# Altium schematic sheet STM32F1_microcontroller.SchDoc
size 420 x 297 mm; SheetNumber: 9; SheetTotal: 9
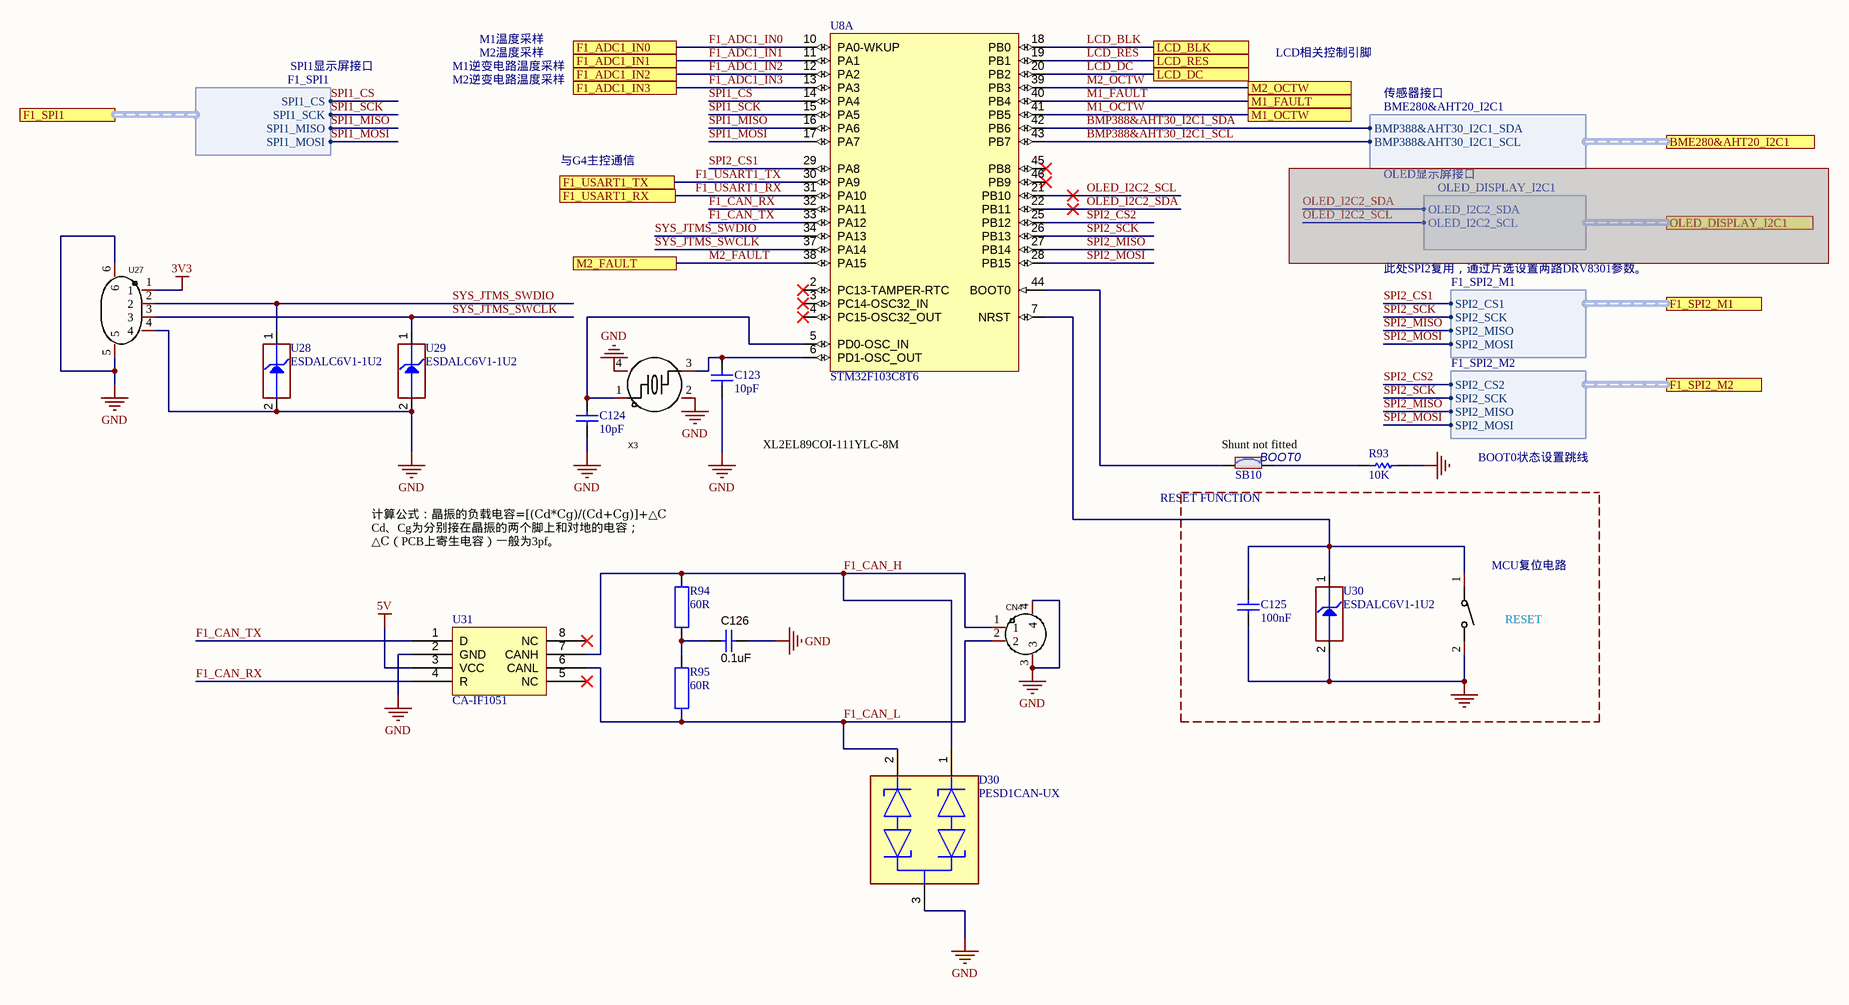
[diagram p0: STM32F1_microcontroller.SchDoc]

## Parts
C123  value 10pF  [C0402]
C124  value 10pF  [C0402]
C125  value 100nF  [C0402]
C126  ValueDisplayed: 0.1uF  [0603L]  (hidden comment: GRM188R61E105KA12D)
CN4  WAFER-GH1.25-2PWB  [CONN-TH_2P-P1.25_XUNPU_WAFER-GH1.25-2PWB]  (value not drawn)
D30  PESD1CAN-UX  [FP-SOT323-MFG]
R93  value 10K  [R0603]
R94  60R  [RESC1608X55N]
R95  60R  [RESC1608X55N]
SB10  MCD-00071  [SOLDER-BRIDGE_R0603-0R]  (value not drawn)
SW2  TS-1088-AR02016  [SW-SMD_L3.9-W3.0-P4.45]  (value not drawn)
U8  STM32F103C8T6  [STM-LQFP48_L]  (part A of 2)
U27  WAFER-GH1.25-4PWB  [CONN-SMD_4P-P1.25_XUNPU_WAFER-GH1.25-4PWB]  (value not drawn)
U28  value ESDALC6V1-1U2  [ESD_ST0201]
U29  value ESDALC6V1-1U2  [ESD_ST0201]
U30  value ESDALC6V1-1U2  [ESD_ST0201]
U31  CA-IF1051  [SOIC127P600X175-8N]
X3  8MHz  [CRYSTAL-SMD_4P-L3.2-W2.5-BL-1]  (value not drawn)

## Ports
BME280&AHT20_I2C1 (harness BME280&AHT20_I2C1, see STM32G4_DRV8301_hardware_TOP_V1.0[3B], DRV8301_SENSE[3D]), F1_ADC1_IN0 (see STM32G4_DRV8301_hardware_TOP_V1.0[2B]), F1_ADC1_IN1 (see STM32G4_DRV8301_hardware_TOP_V1.0[2B]), F1_ADC1_IN2 (see STM32G4_DRV8301_hardware_TOP_V1.0[2B]), F1_ADC1_IN3 (see STM32G4_DRV8301_hardware_TOP_V1.0[2B]), F1_SPI1 (harness F1_SPI1, see STM32G4_DRV8301_hardware_TOP_V1.0[3B], DRV8301_SENSE[4D]), F1_SPI2_M1 (harness F1_SPI2_M1, see STM32G4_DRV8301_hardware_TOP_V1.0[3B], M1_DRV8301_driver[3C]), F1_SPI2_M2 (harness F1_SPI2_M2, see STM32G4_DRV8301_hardware_TOP_V1.0[3B], M2_DRV8301_driver[3C]), F1_USART1_RX (see STM32G4_DRV8301_hardware_TOP_V1.0[2B]), F1_USART1_TX (see STM32G4_DRV8301_hardware_TOP_V1.0[2B]), LCD_BLK (see STM32G4_DRV8301_hardware_TOP_V1.0[3B]), LCD_DC (see STM32G4_DRV8301_hardware_TOP_V1.0[3B]), LCD_RES (see STM32G4_DRV8301_hardware_TOP_V1.0[3B]), M1_FAULT (see STM32G4_DRV8301_hardware_TOP_V1.0[2B]), M1_OCTW (see STM32G4_DRV8301_hardware_TOP_V1.0[2B]), M2_FAULT (see STM32G4_DRV8301_hardware_TOP_V1.0[2B]), M2_OCTW (see STM32G4_DRV8301_hardware_TOP_V1.0[2B]), OLED_DISPLAY_I2C1 (harness OLED_DISPLAY_I2C1, see STM32G4_DRV8301_hardware_TOP_V1.0[3B])

## Harnesses
F1_SPI1: SPI1_CS, SPI1_SCK, SPI1_MISO, SPI1_MOSI
BME280&AHT20_I2C1: BMP388&AHT30_I2C1_SDA, BMP388&AHT30_I2C1_SCL
OLED_DISPLAY_I2C1: OLED_I2C2_SDA, OLED_I2C2_SCL
F1_SPI2_M1: SPI2_CS1, SPI2_SCK, SPI2_MISO, SPI2_MOSI
F1_SPI2_M2: SPI2_SCK, SPI2_MISO, SPI2_MOSI, SPI2_CS2

## Nets
3V3: U27.1
5V: U31.3(VCC)
GND: C123.2 C124.2 C125.1 C126.2 CN4.3 CN4.4 D30.3(common_cathode) R93.1 SW2.2 U27.4 U27.5 U27.6 U28.2(GND) U29.2(GND) U30.2(GND) U31.2(GND) X3.2(GND) X3.4(GND)
BMP388&AHT30_I2C1_SCL: U8.43(PB7) ; port BME280&AHT20_I2C1.BMP388&AHT30_I2C1_SCL
BMP388&AHT30_I2C1_SDA: U8.42(PB6) ; port BME280&AHT20_I2C1.BMP388&AHT30_I2C1_SDA
F1_ADC1_IN0: U8.10(PA0-WKUP) ; port F1_ADC1_IN0
F1_ADC1_IN1: U8.11(PA1) ; port F1_ADC1_IN1
F1_ADC1_IN2: U8.12(PA2) ; port F1_ADC1_IN2
F1_ADC1_IN3: U8.13(PA3) ; port F1_ADC1_IN3
F1_CAN_H: CN4.1 D30.1(cathode_1) R94.2 U31.7(CANH)
F1_CAN_L: CN4.2 D30.2(cathode_2) R95.1 U31.6(CANL)
F1_CAN_RX: U8.32(PA11) U31.4(R)
F1_CAN_TX: U8.33(PA12) U31.1(D)
F1_USART1_RX: U8.31(PA10) ; port F1_USART1_RX
F1_USART1_TX: U8.30(PA9) ; port F1_USART1_TX
LCD_BLK: U8.18(PB0) ; port LCD_BLK
LCD_DC: U8.20(PB2) ; port LCD_DC
LCD_RES: U8.19(PB1) ; port LCD_RES
M1_FAULT: U8.40(PB4) ; port M1_FAULT
M1_OCTW: U8.41(PB5) ; port M1_OCTW
M2_FAULT: U8.38(PA15) ; port M2_FAULT
M2_OCTW: U8.39(PB3) ; port M2_OCTW
OLED_I2C2_SCL: U8.21(PB10)
OLED_I2C2_SDA: U8.22(PB11)
SPI1_CS: U8.14(PA4) ; port F1_SPI1.SPI1_CS
SPI1_MISO: U8.16(PA6) ; port F1_SPI1.SPI1_MISO
SPI1_MOSI: U8.17(PA7) ; port F1_SPI1.SPI1_MOSI
SPI1_SCK: U8.15(PA5) ; port F1_SPI1.SPI1_SCK
SPI2_CS1: U8.29(PA8) ; port F1_SPI2_M1.SPI2_CS1
SPI2_CS2: U8.25(PB12) ; port F1_SPI2_M2.SPI2_CS2
SPI2_MISO: U8.27(PB14) ; port F1_SPI2_M1.SPI2_MISO, port F1_SPI2_M2.SPI2_MISO
SPI2_MOSI: U8.28(PB15) ; port F1_SPI2_M1.SPI2_MOSI, port F1_SPI2_M2.SPI2_MOSI
SPI2_SCK: U8.26(PB13) ; port F1_SPI2_M1.SPI2_SCK, port F1_SPI2_M2.SPI2_SCK
SYS_JTMS_SWCLK: U8.37(PA14) U27.3 U29.1(IO1)
SYS_JTMS_SWDIO: U8.34(PA13) U27.2 U28.1(IO1)
NetC123_1: C123.1 U8.6(PD1-OSC_OUT) X3.3
NetC124_1: C124.1 U8.5(PD0-OSC_IN) X3.1
NetC125_2: C125.2 SW2.1 U8.7(NRST) U30.1(IO1)
NetC126_1: C126.1 R94.1 R95.2
NetR93_2: R93.2 SB10.2
NetSB10_1: SB10.1 U8.44(BOOT0)

Not connected (* = marked no-connect by the designer): U8 2(PC13-TAMPER-RTC)* 3(PC14-OSC32_IN)* 4(PC15-OSC32_OUT)* 45(PB8)* 46(PB9)*; U31 5(NC)* 8(NC)*

## Notes on the sheet
- SPI1显示屏接口
- M1逆变电路温度采样
- M2逆变电路温度采样
- M1温度采样
- M2温度采样
- LCD相关控制引脚
- 传感器接口
- 与G4主控通信
- OLED显示屏接口
- 此处SPI2复用，通过片选设置两路DRV8301参数。
- XL2EL89COI-111YLC-8M
- (near SB10) Shunt not fitted
- BOOT0
- BOOT0状态设置跳线
- (near R94) 计算公式：晶振的负载电容=[(Cd*Cg)/(Cd+Cg)]+△C
  Cd、Cg为分别接在晶振的两个脚上和对地的电容；
  △C（PCB上寄生电容）一般为3pf。
- RESET FUNCTION
- (near SW2) MCU复位电路
- (near SW2) RESET
- THIS DOCUMENT AND THE DATA DISCLOSED HEREIN OR
- HEREWITH IS THE PROPERTY OF ALTIUM LIMITED AND MAY
- DWG NO:
- REVISION
- REV:
- DESCRIPTION
- DATE
- APPROVED
- BE FREELY DISTRIBUTED IN WHOLE. NO RIGHTS ARE
- RESERVED OR EXPRESS OR IMPLIED WARANTEE GIVEN.
- ENG:
- APPROVALS
- PROJECT
- DSN:
- CHK:
- REFERENCE DOCUMENTS
- PROJECT REVISION:
- TITLE
- DOCUMENT REVISION:
- DESIGN ITEM:
- BOM:
- FAB DWG:
- PCB DWG:
- ASSY DWG:
- SCALE:
- A3
- SIZE
- CAGE CODE
- FILE NAME
- DWG NO.
- SHEET
- OF
- REV

## Library data of the parts
C123 C124 = MCD-00003: Capacitor, MLCC, 5.1pF, 50V, NPO, +-0.25pF, 0402, T=0.5mm; Manufacturer_Part_Number: CC0402CRNPO9BN5R1; Manufacturer: YAGEO; ECCN_US: EAR99; ECCN_EU: NEC; Provided_By: SUBCO; Internal_Part_Number: MCD-00003; ComponentLink1Description: Datasheet; Status: Released; Part_Type: Capacitor; Package: C0402; ComponentLink1URL: http://tunmcdsvn.tun.st.com/Component_Datasheet_Library/Trunk/Capacitors/Yageo_Capacitor_NP0_16V-to-50V
C125 = MCD-00102: Capacitor, MLCC, 100nF, 16V, X7R, 10%, 0402, T=0,5mm; Manufacturer_Part_Number: CC0402KRX7R7BB104; Manufacturer: YAGEO; Provided_By: Subcon; Initial_Board_Reference: MB1262; Internal_Part_Number: MCD-00102; Status: Released; Package: C0402; ComponentLink1Description: Yageo_Capacitor_X7R-series.pdf; ECCN_US: n/a; ECCN_EU: n/a; Part_Type: Capacitor; ComponentLink1URL: http://tunmcdsvn.tun.st.com/Component_Datasheet_Library/Trunk/Capacitors/Yageo_Multilayer_Capacitor_X7R_series_100pF_to_22uF
C126 = GRM188R61E105KA12D: CAP, CERM, 0.1uF, 25V, +/-10%, X5R, 0603; Manufacturer: MuRata; Polarized: N; CompType: Capacitor; Value: 1uF; U/M: EA; Cap_F: 0.000001; Tolerance_%: 10; Value1: Unknown; VDC_V: 25; TaMin_C: -55; TaMax_C: 85; Cap_Case: 0603; SymbolVersion: 2008-07-09; PartNumber: GRM188R61E105KA12D; PackageReference: 0603; RoHS: Y; Value2: 25V; MountType: SMT; Technology: Ceramic; TempCo: X5R; Published: 2008-06-19; Publisher: Texas Instruments; LatestRevisionDate: 2013-05-24; LatestRevisionNote: Changed publisher; ComponentLink1Description: Datasheet link; ComponentLink1URL: http://search.murata.co.jp/Ceramy/PnsearchViewAction.do?HnOFG=ON&HnNFG=ON&SEL_CNT=50&sLang=en&sKey=GRM188R61E105KA12D&x=9&y=9&search=startwith; Supplier 1: Digi-Key; Supplier Part Number 1: 490-3897-1-ND; Supplier 2: Mouser; Supplier Part Number 2: 81-GRM188R61E105KA12; Supplier 3: Farnell; Supplier Part Number 3: 1828802
CN4 = WAFER-GH1.25-2PWB: Manufacturer: XUNPU(讯普); Add into BOM: yes; Pins Structure: 1x2P; Pitch: 1.25mm; Reference Series: GH; Number of PINs Per Row: 2; Current Rating (Max): 1A; Symbol: WAFER-GH1.25-2PWB; Device: WAFER-GH1.25-2PWB; LCSC Part Name: 1x2P 间距:1.25mm 卧贴 系列:GH; Supplier Part: C3029377; Manufacturer Part: WAFER-GH1.25-2PWB; Supplier Footprint: SMD,P=1.25mm,卧贴; JLCPCB Part Class: Extended Part; Datasheet: https://atta.szlcsc.com/upload/public/pdf/source/20220527/CB8773BFB0913C3B8ABD62CB38BA101A.pdf; Supplier: LCSC; Convert to PCB: yes; Mounting Style: 卧贴; Number of Pins: 2P; Number of Rows: 1; Operating Temperature Range: -25℃~+85℃
D30 = CMP-14436-000006-1: TVS DIODE 24V 50V SC70-3
R93 = MCD-00220: Resistor,10K,0603,1%,1/10W; Manufacturer_Part_Number: RC0603FR-0710KL; Manufacturer: YAGEO; Provided_By: Subcon; Initial_Board_Reference: MB1319; Internal_Part_Number: MCD-00220; ECCN_US: n/a; ECCN_EU: n/a; ComponentLink1Description: Yageo_Resistor_RC0603-series.pdf; Status: Released; Part_Type: Resistor; Package: R0603; ComponentLink1URL: http://tunmcdsvn.tun.st.com/Component_Datasheet_Library/Trunk/Resistors/Yageo_Resistor_RC0603-series
R94 R95 = RC0603FR-07120RL: RES SMD 60 OHM 1% 1/10W 0603; Manufacturer: Yageo; Resistance (Ohms): 120; Power (Watts): 0.1W, 1/10W; Temperature Coefficient: ±100ppm/°C; Supplier 1: Digi-Key; Supplier Part Number 1: 311-120HRCT-ND; Manufacturer Part Number: RC0603FR-07120RL; RoHS: RoHS Compliant; Category: Resistors; Stock 1: 1545282; Pricing 1: 1=0.1, 10=0.014, 25=0.01, 100=0.0057, 250=0.00436, 500=0.00348, 1000=0.00257, 2500=0.00223 (USD); Packaging: Cut Tape (CT); Tolerance: ±1%; Composition: Thick Film; Features: Moisture Resistant; Operating Temperature: -55°C ~ 155°C; Package / Case: 0603 (1608 Metric); Supplier Device Package: 0603; Size / Dimension: 0.063" L x 0.031" W (1.60mm x 0.80mm); Height: 0.022" (0.55mm); Number of Terminations: 2; ComponentLink1URL: http://www.yageo.com/documents/recent/PYu-RC_Group_51_RoHS_L_04.pdf; ComponentLink1Description: http://www.yageo.com/documents/recent/PYu-RC_Group_51_RoHS_L_04.pdf
SB10 = MCD-00071: Solder Bridge ON; Part_Type: Mechanical; Manufacturer_Part_Number: RC0603JR-070RL; Manufacturer: YAGEO; Provided_By: SUBCO; Internal_Part_Number: MCD-00071; ECCN_US: n/a; ECCN_EU: n/a; Status: Released; Package: SB0603; ComponentLink1Description: Datasheet; ComponentLink1URL: http://tunmcdsvn.tun.st.com/Component_Datasheet_Library/Trunk/Resistors/Yageo_Resistor_RC0603-series
SW2 = TS-1088-AR02016: Manufacturer: XUNPU(讯普); Add into BOM: yes; Circuit: 单刀单掷; Actuator Style: 圆形按钮; Operating Force: 160gf; Switch Length: 4mm; Switch Width: 3mm; Switch Height: 2mm; Strike Gundam: 不带; Contact Current: 50mA; Voltage Rating (DC): 12V; Insulation Resistance: 100MΩ; Actuator/Cap Color: 黑色; Pin Style: SMD接片; Mechanical Life: 10万次; Symbol: TS-1088-AR02016; Device: TS-1088-AR02016; LCSC Part Name: 4*3*2mm 立贴 轻触开关; Supplier Part: C720477; Manufacturer Part: TS-1088-AR02016; Supplier Footprint: SMD; JLCPCB Part Class: Extended Part; Datasheet: https://atta.szlcsc.com/upload/public/pdf/source/20200810/C720475_60D09DD6C54279ADDB2DC25100F1CC11.pdf; Supplier: LCSC; Convert to PCB: yes; Mounting Style: 立贴; Operating Temperature: -30℃~+80℃
U8 = CMP-0237-00215-3: ARM Cortex-M3 32-bit MCU, 64 KB Flash, 20 KB Internal RAM, 37 I/Os, 48-pin LQFP, -40 to 85 degC, Tray; Supply Voltage(Vcc) min (V): 2; Internal RAM Size (kB): 20; FLASH Size (Prog) (kB): 64; A/D Converter: 2x12-bit (10 Channel); I/Os (High Current): 37; Operating Frequency(F) (Processor speed) (MHz): 72; Core: ARM Cortex-M3; ComponentLink3Description: Package Specification; Mounting Technology: Surface Mount; PartNumber: STM32F103C8T6; PackageReference: LQFP48; Packing: Tray; ComponentLink3URL: http://www.st.com/st-web-ui/static/active/en/resource/technical/document/datasheet/DM00058181.pdf; DatasheetVersion: Rev. 16; ComponentLink1URL: http://www.st.com/web/en/home.html; PackageVersion: Rev. 6, 06/2013; ComponentLink2URL: http://www.st.com/st-web-ui/static/active/en/resource/technical/document/datasheet/CD00161566.pdf; ComponentLink1Description: Manufacturer URL; ComponentLink2Description: Datasheet; PackageDescription: 48-Pin Low Profile Quad Flat Package, 7 x 7 mm Body, 0.5 mm Pitch
U27 = WAFER-GH1.25-4PWB: Manufacturer: XUNPU(讯普); Add into BOM: yes; Pins Structure: 1x4P; Pitch: 1.25mm; Reference Series: GH; Number of PINs Per Row: 4; Current Rating (Max): 1A; Symbol: WAFER-GH1.25-4PWB; Device: WAFER-GH1.25-4PWB; LCSC Part Name: 1x4P 间距:1.25mm 卧贴 系列:GH; Supplier Part: C3029379; Manufacturer Part: WAFER-GH1.25-4PWB; Supplier Footprint: SMD,P=1.25mm,卧贴; JLCPCB Part Class: Extended Part; Datasheet: https://atta.szlcsc.com/upload/public/pdf/source/20220527/CB8773BFB0913C3B8ABD62CB38BA101A.pdf; Supplier: LCSC; Convert to PCB: yes; Mounting Style: 卧贴; Number of Pins: 4P; Number of Rows: 1; Operating Temperature Range: -25℃~+85℃
U28-U30 = MCD-00170: ESD protection 6V1; Part_Type: Diode; Manufacturer: STMICROELECTRONICS; ECCN_US: EAR99; ECCN_EU: NEC; Provided_By: Subcon; Initial_Board_Reference: MB1274; Internal_Part_Number: MCD-00170; Status: Released; Manufacturer_Part_Number: ESDALC6V1-1U2; ComponentLink1Description: STM_ESD_ESDALC6V1-1U2.pdf; ComponentLink1URL: http://tunmcdsvn.tun.st.com/Component_Datasheet_Library/Trunk/Diodes/STM_ESD_ESDALC6V1-1U2
U31 = SN65HVD232D: Manufacturer: Texas Instruments; Protocol: CAN; Number of Drivers/Receivers: 1/1; Duplex: Half; Data Rate: 1Mbps; Voltage - Supply: 3 V ~ 3.6 V; Supplier 1: Digi-Key; Supplier Part Number 1: 296-26344-2-ND; RoHS: RoHS Compliant; Category: Integrated Circuits (ICs); Stock: 5000; Pricing 1: 2500=0.84375 (USD); Packaging: Tape & Reel (TR); Part Status: Active; Type: Transceiver; Operating Temperature: -40°C ~ 85°C; Mounting Type: Surface Mount; Package / Case: 8-SOIC (0.154", 3.90mm Width); Supplier Device Package: 8-SOIC; ComponentLink1URL: http://www.ti.com/lit/ds/symlink/sn65hvd230.pdf; ComponentLink1Description: http://www.ti.com/lit/ds/symlink/sn65hvd230.pdf; Supplier 2: Digi-Key; Supplier Part Number 2: 296-26344-1-ND; Pricing 2: 1=2.05, 10=1.842, 100=1.4809, 500=1.21668, 1000=1.00811 (USD); Manufacturer Part Number: CA-IF1051
X3 = XL2EL89COI-111YLC-8M: Manufacturer: YXC(扬兴晶振); Add into BOM: yes; Crystal Type: 贴片晶振; Normal temperature Frequency Tolerance: ±10ppm; External load capacitor: 12pF; Frequency Stability(Full temperature range): ±20ppm; Equivalent Series Resistance (ESR): 150Ω; Symbol: XL2EL89COI-111YLC-8M; Device: XL2EL89COI-111YLC-8M; LCSC Part Name: 8MHz ±10ppm 12pF; Supplier Part: C2973805; Manufacturer Part: XL2EL89COI-111YLC-8M; Supplier Footprint: SMD3225-4P; JLCPCB Part Class: Extended Part; Datasheet: https://atta.szlcsc.com/upload/public/pdf/source/20240329/19D5F850207469550BEB00D7DFEDBC7A.pdf; Supplier: LCSC; Convert to PCB: yes; Value: 8MHz; Operating Temperature: -40℃~+85℃